# Altium schematic sheet ADC_MUX.SchDoc
size A
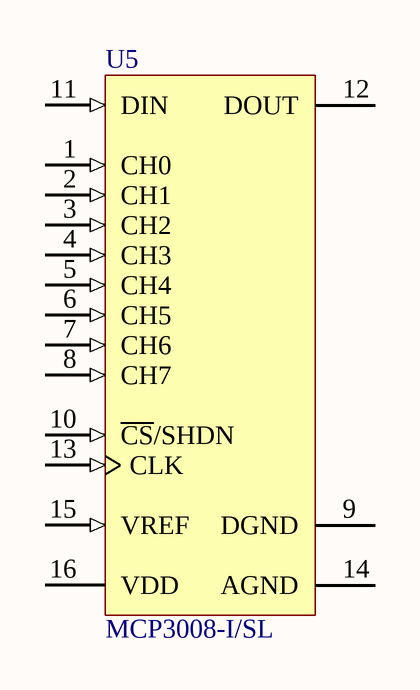
[diagram p0: ADC_MUX.SchDoc]

## Parts
U5  MCP3008-I/SL  [SOIC-SL16_L]

## Nets

Not connected (* = marked no-connect by the designer): U5 1(CH0) 2(CH1) 3(CH2) 4(CH3) 5(CH4) 6(CH5) 7(CH6) 8(CH7) 9(DGND) 10(~{CS}/SHDN) 11(DIN) 12(DOUT) 13(CLK) 14(AGND) 15(VREF) 16(VDD)

## Library data of the parts
U5 = CMP-0188-00041-2: 2.7V 4-Channel/8-Channel 10-Bit A/D Converters with SPI Serial Interface, 16-Pin SOIC 150mil, Industrial Temperature; ComponentLink1URL: http://www.microchip.com/; ComponentLink3Description: Package Specification; PackageDescription: 16-Lead Plastic Small Outline (SL) - Narrow, 3.90mm Body [SOIC]; PackageVersion: revBB, Aug-2009; ComponentLink2Description: Datasheet; Code_IPC: SOIC127P600-16; RevisionNote: URLs added.; ComponentLink3URL: http://www.microchip.com/stellent/groups/techpub_sg/documents/packagingspec/en012702.pdf; ComponentLink1Description: Manufacturer URL; ComponentLink2URL: http://ww1.microchip.com/downloads/en/DeviceDoc/21295d.pdf; Code_JEDEC: MS-012-AC; DatasheetVersion: revD, Dec-2008; PackageReference: SOIC-SL16